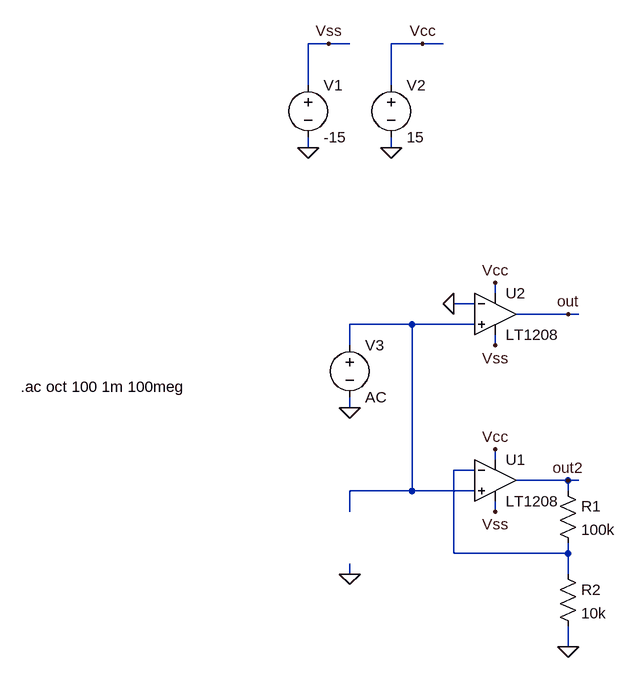
[diagram p0: schematic Draft11.asc]
Draft11.asc, the LTspice schematic file:
Version 4
SHEET 1 880 724
WIRE -64 -224 -96 -224
WIRE -32 -224 -64 -224
WIRE 80 -224 32 -224
WIRE 112 -224 80 -224
WIRE -96 -160 -96 -224
WIRE 32 -160 32 -224
WIRE -96 -64 -96 -80
WIRE 32 -64 32 -80
WIRE 192 160 192 144
WIRE 160 176 128 176
WIRE 304 192 224 192
WIRE 320 192 304 192
WIRE 64 208 -32 208
WIRE 160 208 64 208
WIRE -32 240 -32 208
WIRE 192 240 192 224
WIRE -32 336 -32 320
WIRE 192 416 192 400
WIRE 160 432 128 432
WIRE 304 448 224 448
WIRE 320 448 304 448
WIRE 64 464 64 208
WIRE 64 464 -32 464
WIRE 160 464 64 464
WIRE 304 464 304 448
WIRE -32 496 -32 464
WIRE 192 496 192 480
WIRE 128 560 128 432
WIRE 304 560 304 544
WIRE 304 560 128 560
WIRE -32 592 -32 576
WIRE 304 592 304 560
WIRE 304 704 304 672
FLAG -96 -64 0
FLAG 32 -64 0
FLAG 80 -224 Vcc
FLAG -64 -224 Vss
FLAG 192 144 Vcc
FLAG 192 240 Vss
FLAG 304 192 out
FLAG -32 336 0
FLAG 128 176 0
FLAG 192 400 Vcc
FLAG 192 496 Vss
FLAG 304 448 out2
FLAG -32 592 0
FLAG 304 704 0
SYMBOL voltage -96 -176 R0
SYMATTR InstName V1
SYMATTR Value -15
SYMBOL voltage 32 -176 R0
SYMATTR InstName V2
SYMATTR Value 15
SYMBOL voltage -32 224 R0
WINDOW 123 0 0 Left 2
WINDOW 39 0 0 Left 2
SYMATTR InstName V3
SYMATTR Value AC
SYMBOL Opamps\\LT1208 192 128 R0
SYMATTR InstName U2
SYMBOL Opamps\\LT1208 192 384 R0
SYMATTR InstName U1
SYMBOL res 288 448 R0
SYMATTR InstName R1
SYMATTR Value 100k
SYMBOL res 288 576 R0
SYMATTR InstName R2
SYMATTR Value 10k
TEXT -538 304 Left 2 !.ac oct 100 1m 100meg

The netlist it stands for:
* Draft11.asc
V1 Vss 0 -15
V2 Vcc 0 15
V3 N001 0 AC
XU2 N001 0 Vcc Vss out LT1208  ; pins In+ In- V+ V- OUT
XU1 N001 N002 Vcc Vss out2 LT1208  ; pins In+ In- V+ V- OUT
R1 out2 N002 100k
R2 N002 0 10k
.ac oct 100 1m 100meg
.backanno
.end